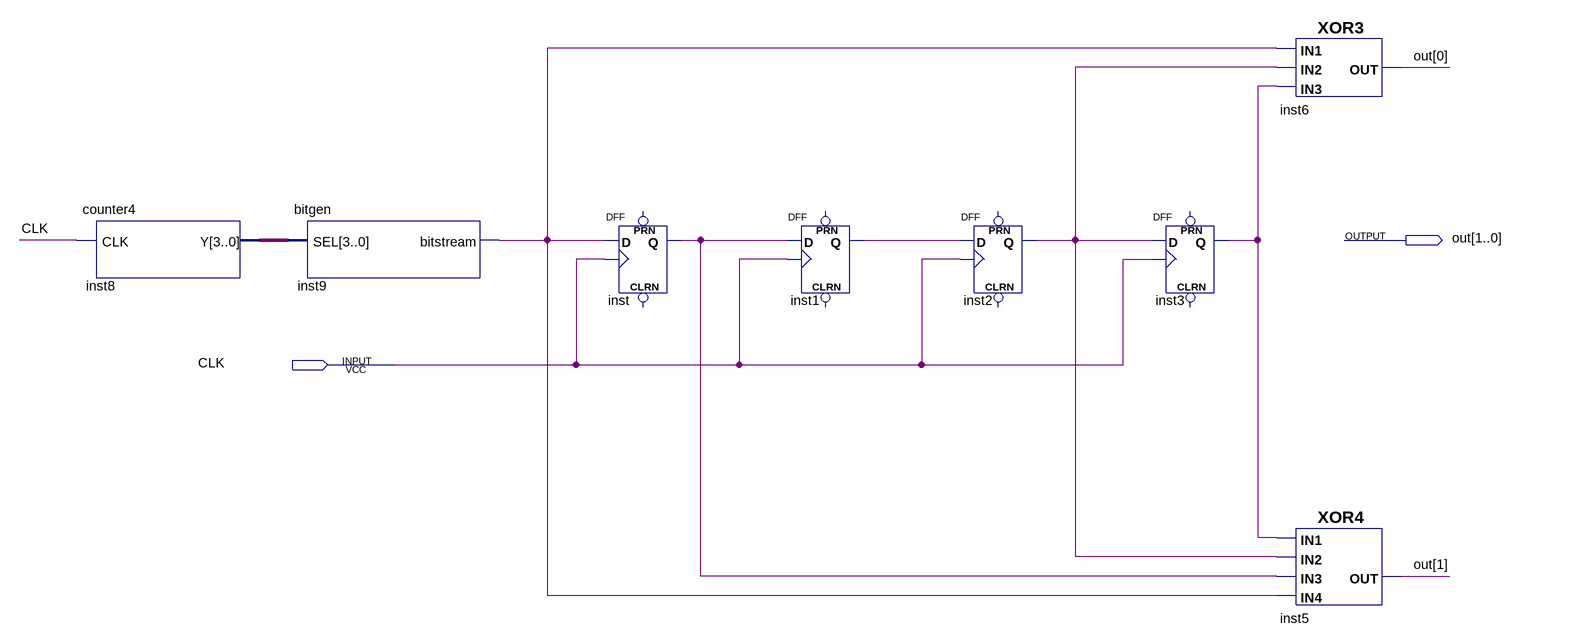
[diagram p0: schematic sheet]
// Quartus schematic convolutional_encoder.bdf as structural Verilog: 8 symbols, 2 pins
module convolutional_encoder (
  input  CLK,
  output [1:0] out
);

  wire inst1_q, inst2_q, inst3_q, inst9_bitstream, inst_q;
  wire [3:0] inst8_y;

  counter4 inst8 (.CLK(CLK), .Y(inst8_y));
  bitgen inst9 (.SEL(inst8_y), .bitstream(inst9_bitstream));
  DFF inst (.CLK(CLK), .D(inst9_bitstream), .Q(inst_q));  // open: CLRN, PRN
  DFF inst1 (.CLK(CLK), .D(inst_q), .Q(inst1_q));  // open: CLRN, PRN
  DFF inst2 (.CLK(CLK), .D(inst1_q), .Q(inst2_q));  // open: CLRN, PRN
  DFF inst3 (.CLK(CLK), .D(inst2_q), .Q(inst3_q));  // open: CLRN, PRN
  XOR3 inst6 (.IN3(inst3_q), .IN1(inst9_bitstream), .IN2(inst2_q), .OUT(out[0]));
  XOR4 inst5 (.IN3(inst_q), .IN4(inst9_bitstream), .IN2(inst2_q), .IN1(inst3_q), .OUT(out[1]));
endmodule
